# Altium schematic sheet Part02_MT7688_DDR.SchDoc
size A4
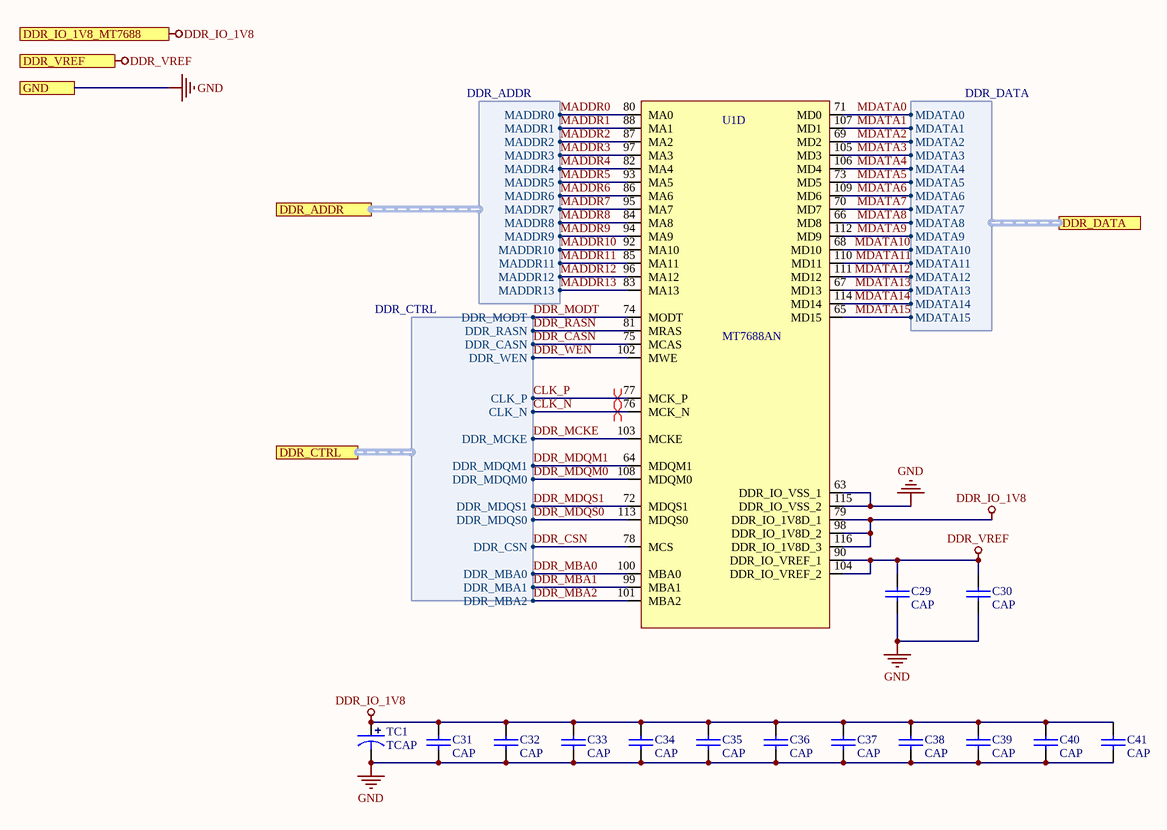
[diagram p0: Part02_MT7688_DDR.SchDoc]

## Parts
C29  CAP  [0402C]
C30  CAP  [0402C]
C31  CAP  [0402C]
C32  CAP  [0402C]
C33  CAP  [0402C]
C34  CAP  [0402C]
C35  CAP  [0402C]
C36  CAP  [0402C]
C37  CAP  [0402C]
C38  CAP  [0402C]
C39  CAP  [0402C]
C40  CAP  [0402C]
C41  CAP  [0402C]
TC1  TCAP  [TAJ-A/3216]
U1  MT7688AN  [MT7628AN$2F$DRQFN156$2F$SMD$2F$P0.5$2F$12X12]  (part D of 6)

## Ports
DDR_ADDR (harness DDR_ADDR), DDR_CTRL (harness DDR_CTRL), DDR_DATA (harness DDR_DATA), DDR_IO_1V8_MT7688, DDR_VREF, GND

## Harnesses
DDR_ADDR: MADDR0, MADDR1, MADDR2, MADDR3, MADDR4, MADDR5, MADDR6, MADDR7, MADDR8, MADDR9, MADDR10, MADDR11, MADDR12, MADDR13
DDR_DATA: MDATA0, MDATA1, MDATA2, MDATA3, MDATA4, MDATA5, MDATA6, MDATA7, MDATA8, MDATA9, MDATA10, MDATA11, MDATA12, MDATA13, MDATA14, MDATA15
DDR_CTRL: DDR_MODT, DDR_RASN, DDR_CASN, DDR_WEN, CLK_P, CLK_N, DDR_MCKE, DDR_MDQM1, DDR_MDQM0, DDR_MDQS1, DDR_MDQS0, DDR_CSN, DDR_MBA0, DDR_MBA1, DDR_MBA2

## Nets
DDR_IO_1V8: C31.1 C32.1 C33.1 C34.1 C35.1 C36.1 C37.1 C38.1 C39.1 C40.1 C41.1 TC1.1 U1.79(DDR_IO_1V8D_1) U1.98(DDR_IO_1V8D_2) U1.116(DDR_IO_1V8D_3) ; port DDR_IO_1V8_MT7688
DDR_VREF: C29.1 C30.1 U1.90(DDR_IO_VREF_1) U1.104(DDR_IO_VREF_2) ; port DDR_VREF
GND: C29.2 C30.2 C31.2 C32.2 C33.2 C34.2 C35.2 C36.2 C37.2 C38.2 C39.2 C40.2 C41.2 TC1.2 U1.63(DDR_IO_VSS_1) U1.115(DDR_IO_VSS_2) ; port GND
CLK_N: U1.76(MCK_N) ; port DDR_CTRL.CLK_N
CLK_P: U1.77(MCK_P) ; port DDR_CTRL.CLK_P
DDR_CASN: U1.75(MCAS) ; port DDR_CTRL.DDR_CASN
DDR_CSN: U1.78(MCS) ; port DDR_CTRL.DDR_CSN
DDR_MBA0: U1.100(MBA0) ; port DDR_CTRL.DDR_MBA0
DDR_MBA1: U1.99(MBA1) ; port DDR_CTRL.DDR_MBA1
DDR_MBA2: U1.101(MBA2) ; port DDR_CTRL.DDR_MBA2
DDR_MCKE: U1.103(MCKE) ; port DDR_CTRL.DDR_MCKE
DDR_MDQM0: U1.108(MDQM0) ; port DDR_CTRL.DDR_MDQM0
DDR_MDQM1: U1.64(MDQM1) ; port DDR_CTRL.DDR_MDQM1
DDR_MDQS0: U1.113(MDQS0) ; port DDR_CTRL.DDR_MDQS0
DDR_MDQS1: U1.72(MDQS1) ; port DDR_CTRL.DDR_MDQS1
DDR_MODT: U1.74(MODT) ; port DDR_CTRL.DDR_MODT
DDR_RASN: U1.81(MRAS) ; port DDR_CTRL.DDR_RASN
DDR_WEN: U1.102(MWE) ; port DDR_CTRL.DDR_WEN
MADDR0: U1.80(MA0) ; port DDR_ADDR.MADDR0
MADDR1: U1.88(MA1) ; port DDR_ADDR.MADDR1
MADDR2: U1.87(MA2) ; port DDR_ADDR.MADDR2
MADDR3: U1.97(MA3) ; port DDR_ADDR.MADDR3
MADDR4: U1.82(MA4) ; port DDR_ADDR.MADDR4
MADDR5: U1.93(MA5) ; port DDR_ADDR.MADDR5
MADDR6: U1.86(MA6) ; port DDR_ADDR.MADDR6
MADDR7: U1.95(MA7) ; port DDR_ADDR.MADDR7
MADDR8: U1.84(MA8) ; port DDR_ADDR.MADDR8
MADDR9: U1.94(MA9) ; port DDR_ADDR.MADDR9
MADDR10: U1.92(MA10) ; port DDR_ADDR.MADDR10
MADDR11: U1.85(MA11) ; port DDR_ADDR.MADDR11
MADDR12: U1.96(MA12) ; port DDR_ADDR.MADDR12
MADDR13: U1.83(MA13) ; port DDR_ADDR.MADDR13
MDATA0: U1.71(MD0) ; port DDR_DATA.MDATA0
MDATA1: U1.107(MD1) ; port DDR_DATA.MDATA1
MDATA2: U1.69(MD2) ; port DDR_DATA.MDATA2
MDATA3: U1.105(MD3) ; port DDR_DATA.MDATA3
MDATA4: U1.106(MD4) ; port DDR_DATA.MDATA4
MDATA5: U1.73(MD5) ; port DDR_DATA.MDATA5
MDATA6: U1.109(MD6) ; port DDR_DATA.MDATA6
MDATA7: U1.70(MD7) ; port DDR_DATA.MDATA7
MDATA8: U1.66(MD8) ; port DDR_DATA.MDATA8
MDATA9: U1.112(MD9) ; port DDR_DATA.MDATA9
MDATA10: U1.68(MD10) ; port DDR_DATA.MDATA10
MDATA11: U1.110(MD11) ; port DDR_DATA.MDATA11
MDATA12: U1.111(MD12) ; port DDR_DATA.MDATA12
MDATA13: U1.67(MD13) ; port DDR_DATA.MDATA13
MDATA14: U1.114(MD14) ; port DDR_DATA.MDATA14
MDATA15: U1.65(MD15) ; port DDR_DATA.MDATA15

## Layout directives
differential pair: CLK_N, CLK_P

## Library data of the parts
C29-C41 = CAP: 无极性电容
TC1 = TCAP: 钽电容